# EAGLE design 16 ch sample-and-hold card - 2 (EAGLE 6.5.0)
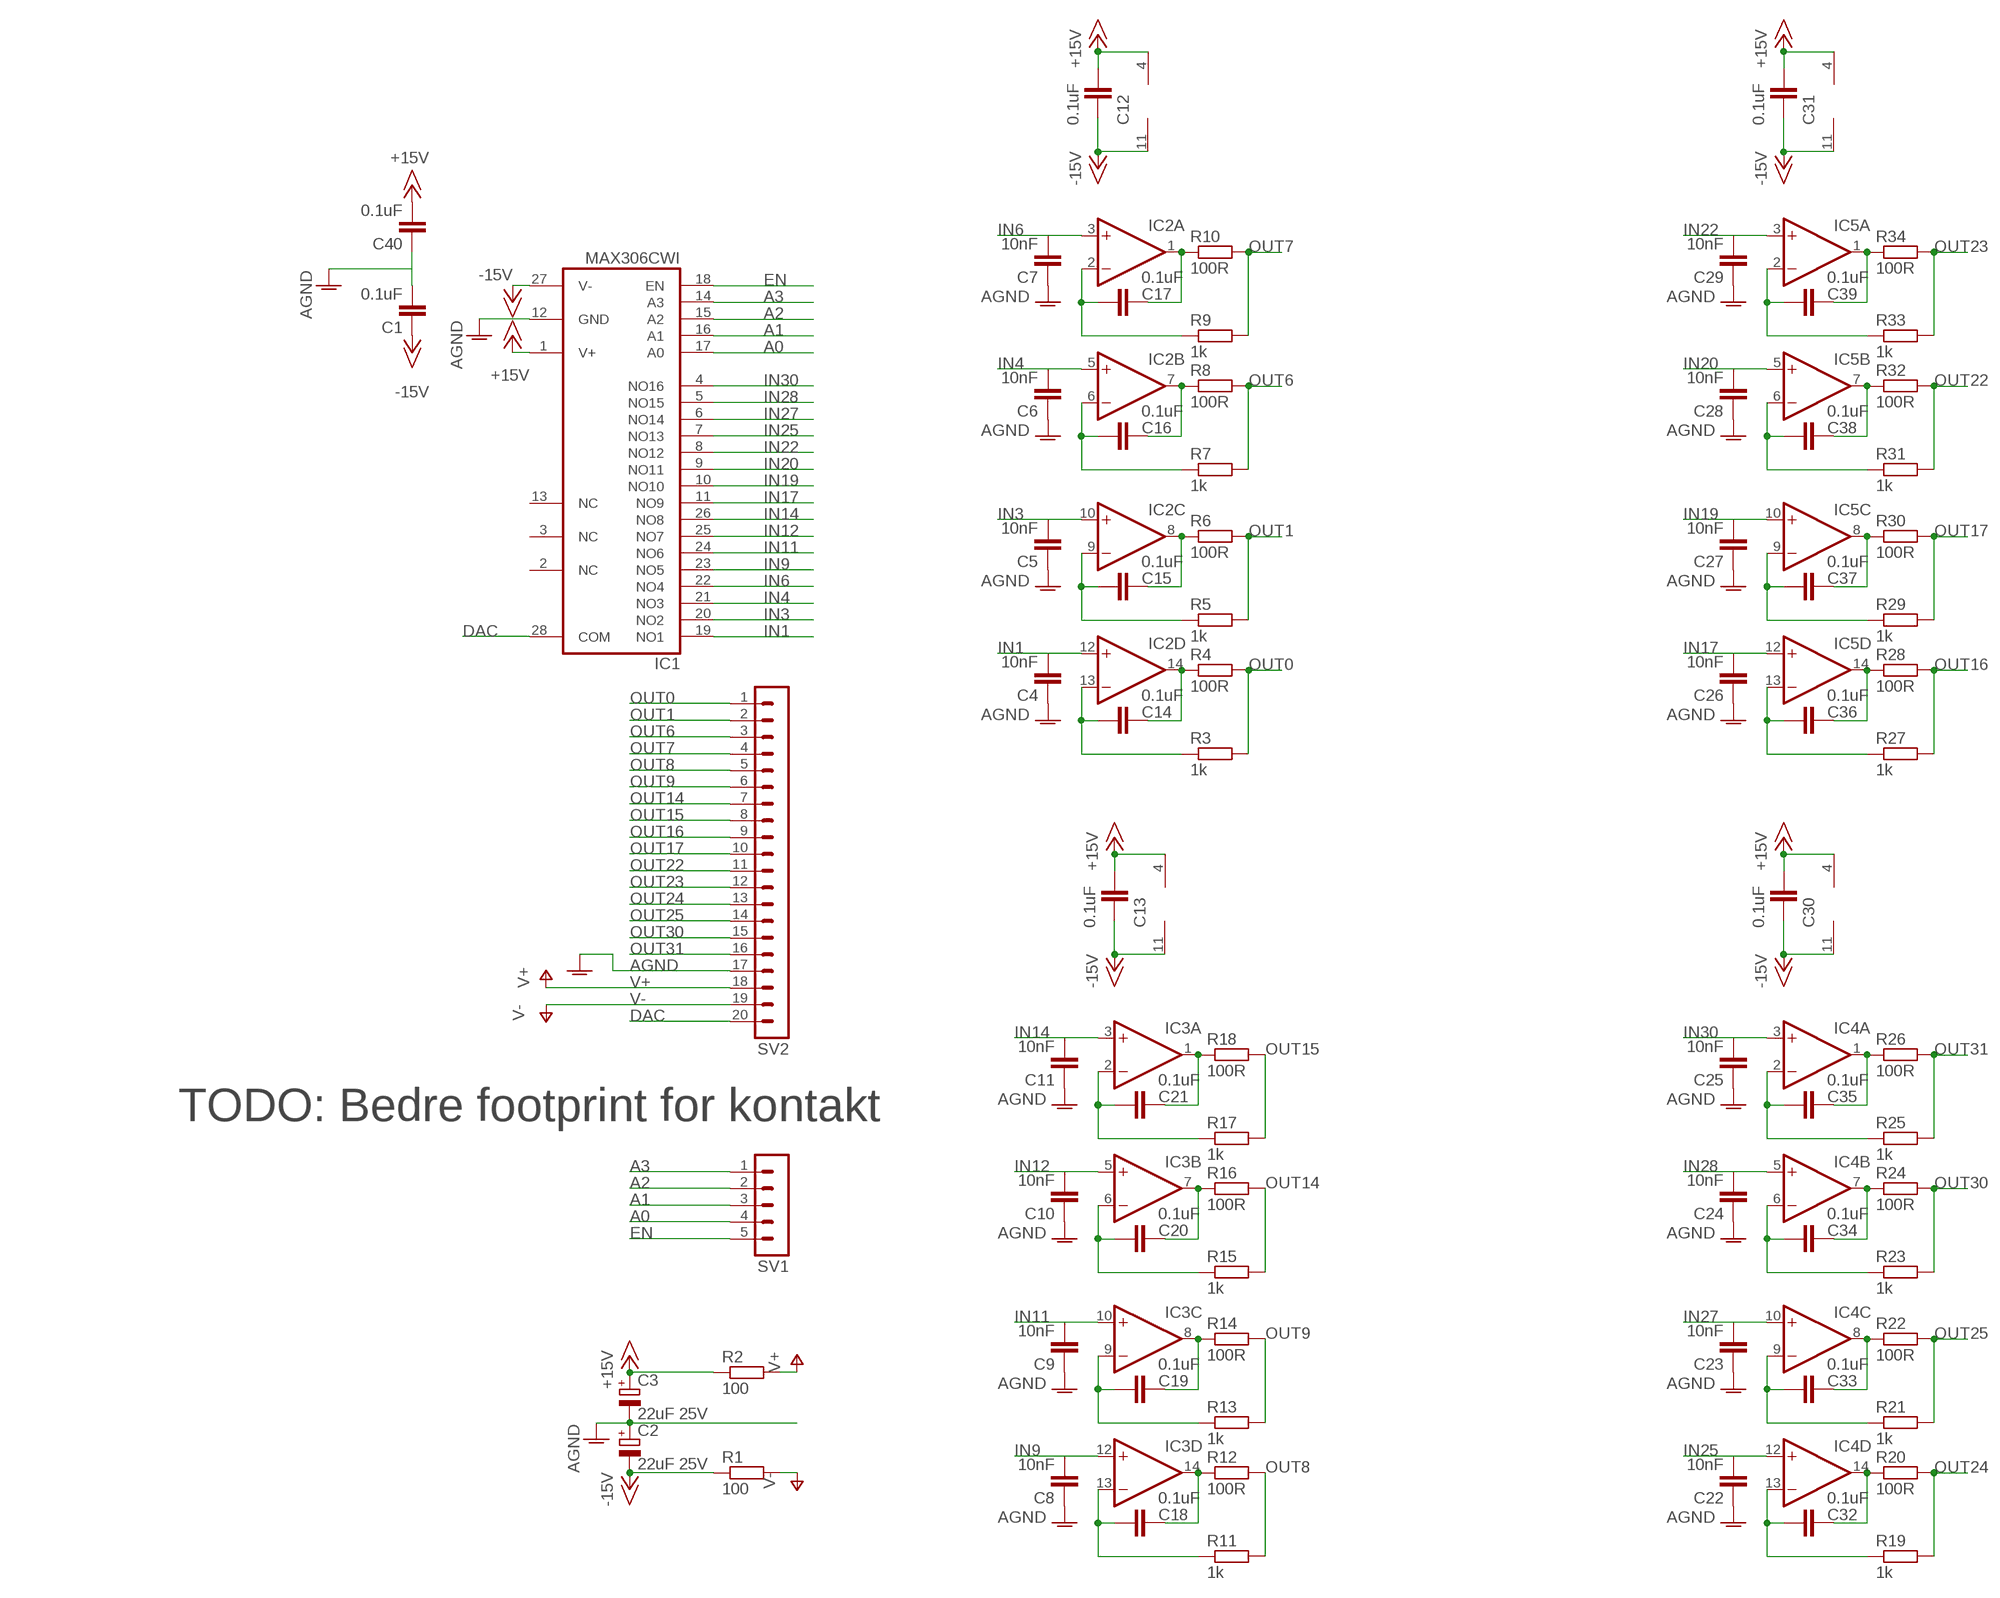
[diagram p0: schematic, sheet 1]

## Parts
C1  0.1uF  C-EUC0603  [C0603]
C2  22uF 25V  CPOL-EUE2-5  [E2-5]
C3  22uF 25V  CPOL-EUE2-5  [E2-5]
C4  10nF  C-EUC1206  [C1206]
C5  10nF  C-EUC1206  [C1206]
C6  10nF  C-EUC1206  [C1206]
C7  10nF  C-EUC1206  [C1206]
C8  10nF  C-EUC1206  [C1206]
C9  10nF  C-EUC1206  [C1206]
C10  10nF  C-EUC1206  [C1206]
C11  10nF  C-EUC1206  [C1206]
C12  0.1uF  C-EUC0603  [C0603]
C13  0.1uF  C-EUC0603  [C0603]
C14  0.1uF  C-EUC0603  [C0603]
C15  0.1uF  C-EUC0603  [C0603]
C16  0.1uF  C-EUC0603  [C0603]
C17  0.1uF  C-EUC0603  [C0603]
C18  0.1uF  C-EUC0603  [C0603]
C19  0.1uF  C-EUC0603  [C0603]
C20  0.1uF  C-EUC0603  [C0603]
C21  0.1uF  C-EUC0603  [C0603]
C22  10nF  C-EUC1206  [C1206]
C23  10nF  C-EUC1206  [C1206]
C24  10nF  C-EUC1206  [C1206]
C25  10nF  C-EUC1206  [C1206]
C26  10nF  C-EUC1206  [C1206]
C27  10nF  C-EUC1206  [C1206]
C28  10nF  C-EUC1206  [C1206]
C29  10nF  C-EUC1206  [C1206]
C30  0.1uF  C-EUC0603  [C0603]
C31  0.1uF  C-EUC0603  [C0603]
C32  0.1uF  C-EUC0603  [C0603]
C33  0.1uF  C-EUC0603  [C0603]
C34  0.1uF  C-EUC0603  [C0603]
C35  0.1uF  C-EUC0603  [C0603]
C36  0.1uF  C-EUC0603  [C0603]
C37  0.1uF  C-EUC0603  [C0603]
C38  0.1uF  C-EUC0603  [C0603]
C39  0.1uF  C-EUC0603  [C0603]
C40  0.1uF  C-EUC0603  [C0603]
IC1  MAX306CWI  [SO28L]
IC2  TL074D  [SO14]
IC3  TL074D  [SO14]
IC4  TL074D  [SO14]
IC5  TL074D  [SO14]
R1  100  R-EU_0207/7  [0207/7]
R2  100  R-EU_0207/7  [0207/7]
R3  1k  R-EU_R0603  [R0603]
R4  100R  R-EU_R0603  [R0603]
R5  1k  R-EU_R0603  [R0603]
R6  100R  R-EU_R0603  [R0603]
R7  1k  R-EU_R0603  [R0603]
R8  100R  R-EU_R0603  [R0603]
R9  1k  R-EU_R0603  [R0603]
R10  100R  R-EU_R0603  [R0603]
R11  1k  R-EU_R0603  [R0603]
R12  100R  R-EU_R0603  [R0603]
R13  1k  R-EU_R0603  [R0603]
R14  100R  R-EU_R0603  [R0603]
R15  1k  R-EU_R0603  [R0603]
R16  100R  R-EU_R0603  [R0603]
R17  1k  R-EU_R0603  [R0603]
R18  100R  R-EU_R0603  [R0603]
R19  1k  R-EU_R0603  [R0603]
R20  100R  R-EU_R0603  [R0603]
R21  1k  R-EU_R0603  [R0603]
R22  100R  R-EU_R0603  [R0603]
R23  1k  R-EU_R0603  [R0603]
R24  100R  R-EU_R0603  [R0603]
R25  1k  R-EU_R0603  [R0603]
R26  100R  R-EU_R0603  [R0603]
R27  1k  R-EU_R0603  [R0603]
R28  100R  R-EU_R0603  [R0603]
R29  1k  R-EU_R0603  [R0603]
R30  100R  R-EU_R0603  [R0603]
R31  1k  R-EU_R0603  [R0603]
R32  100R  R-EU_R0603  [R0603]
R33  1k  R-EU_R0603  [R0603]
R34  100R  R-EU_R0603  [R0603]
SV1  MA05-1  [MA05-1]
SV2  MA20-1  [MA20-1]

## Nets
+15V: C3.+ C12.1 C13.1 C30.1 C31.1 C40.2 IC1.1(V+) IC2.4(P:V+) IC3.4(P:V+) IC4.4(P:V+) IC5.4(P:V+) R2.1
-15V: C1.1 C2.- C12.2 C13.2 C30.2 C31.2 IC1.27(V-) IC2.11(P:V-) IC3.11(P:V-) IC4.11(P:V-) IC5.11(P:V-) R1.1
A0: IC1.17(A0) SV1.4
A1: IC1.16(A1) SV1.3
A2: IC1.15(A2) SV1.2
A3: IC1.14(A3) SV1.1
AGND: C1.2 C2.+ C3.- C4.1 C5.1 C6.1 C7.1 C8.1 C9.1 C10.1 C11.1 C22.1 C23.1 C24.1 C25.1 C26.1 C27.1 C28.1 C29.1 C40.1 IC1.12(GND) SV2.17
DAC: IC1.28(COM) SV2.20
EN: IC1.18(EN) SV1.5
IN1: C4.2 IC1.19(NO1) IC2.12(D:+IN)
IN3: C5.2 IC1.20(NO2) IC2.10(C:+IN)
IN4: C6.2 IC1.21(NO3) IC2.5(B:+IN)
IN6: C7.2 IC1.22(NO4) IC2.3(A:+IN)
IN9: C8.2 IC1.23(NO5) IC3.12(D:+IN)
IN11: C9.2 IC1.24(NO6) IC3.10(C:+IN)
IN12: C10.2 IC1.25(NO7) IC3.5(B:+IN)
IN14: C11.2 IC1.26(NO8) IC3.3(A:+IN)
IN17: C26.2 IC1.11(NO9) IC5.12(D:+IN)
IN19: C27.2 IC1.10(NO10) IC5.10(C:+IN)
IN20: C28.2 IC1.9(NO11) IC5.5(B:+IN)
IN22: C29.2 IC1.8(NO12) IC5.3(A:+IN)
IN25: C22.2 IC1.7(NO13) IC4.12(D:+IN)
IN27: C23.2 IC1.6(NO14) IC4.10(C:+IN)
IN28: C24.2 IC1.5(NO15) IC4.5(B:+IN)
IN30: C25.2 IC1.4(NO16) IC4.3(A:+IN)
N$1: C17.2 IC2.2(A:-IN) R9.1
N$2: C17.1 IC2.1(A:OUT) R10.1
N$3: C16.1 IC2.7(B:OUT) R8.1
N$4: C15.1 IC2.8(C:OUT) R6.1
N$5: C16.2 IC2.6(B:-IN) R7.1
N$6: C14.1 IC2.14(D:OUT) R4.1
N$7: C15.2 IC2.9(C:-IN) R5.1
N$8: C14.2 IC2.13(D:-IN) R3.1
N$9: C21.1 IC3.1(A:OUT) R18.1
N$10: C21.2 IC3.2(A:-IN) R17.1
N$19: C20.1 IC3.7(B:OUT) R16.1
N$20: C20.2 IC3.6(B:-IN) R15.1
N$21: C19.1 IC3.8(C:OUT) R14.1
N$22: C18.1 IC3.14(D:OUT) R12.1
N$23: C19.2 IC3.9(C:-IN) R13.1
N$24: C18.2 IC3.13(D:-IN) R11.1
N$33: C39.1 IC5.1(A:OUT) R34.1
N$34: C39.2 IC5.2(A:-IN) R33.1
N$35: C38.1 IC5.7(B:OUT) R32.1
N$36: C38.2 IC5.6(B:-IN) R31.1
N$37: C37.1 IC5.8(C:OUT) R30.1
N$38: C36.1 IC5.14(D:OUT) R28.1
N$39: C37.2 IC5.9(C:-IN) R29.1
N$40: C36.2 IC5.13(D:-IN) R27.1
N$49: C35.1 IC4.1(A:OUT) R26.1
N$50: C35.2 IC4.2(A:-IN) R25.1
N$51: C34.1 IC4.7(B:OUT) R24.1
N$52: C34.2 IC4.6(B:-IN) R23.1
N$53: C33.1 IC4.8(C:OUT) R22.1
N$54: C32.1 IC4.14(D:OUT) R20.1
N$55: C33.2 IC4.9(C:-IN) R21.1
N$56: C32.2 IC4.13(D:-IN) R19.1
OUT0: R3.2 R4.2 SV2.1
OUT1: R5.2 R6.2 SV2.2
OUT6: R7.2 R8.2 SV2.3
OUT7: R9.2 R10.2 SV2.4
OUT8: R11.2 R12.2 SV2.5
OUT9: R13.2 R14.2 SV2.6
OUT14: R15.2 R16.2 SV2.7
OUT15: R17.2 R18.2 SV2.8
OUT16: R27.2 R28.2 SV2.9
OUT17: R29.2 R30.2 SV2.10
OUT22: R31.2 R32.2 SV2.11
OUT23: R33.2 R34.2 SV2.12
OUT24: R19.2 R20.2 SV2.13
OUT25: R21.2 R22.2 SV2.14
OUT30: R23.2 R24.2 SV2.15
OUT31: R25.2 R26.2 SV2.16
V+: R2.2 SV2.18
V-: R1.2 SV2.19
Unconnected: IC1.2(NC) IC1.3(NC) IC1.13(NC)

## Notes on the sheet
- TODO: Bedre footprint for kontakt

## Library data of the parts
C1 C4-C40 = resistor:C-EU: CAPACITOR, European symbol
C2 C3 = resistor:CPOL-EU: POLARIZED CAPACITOR, European symbol
IC1 = maxim:MAX306CWI: MULTIPLEXER; MF: MAXIM; MPN: MAX306CWI; OC_FARNELL: unknown; OC_NEWARK: 90C2555
IC2-IC5 = linear:TL074: OP AMP
R1-R34 = resistor:R-EU_: RESISTOR, European symbol
SV1 = joakim:MA05-1: PIN HEADER; OC_FARNELL: unknown; OC_NEWARK: unknown
SV2 = joakim:MA20-1: PIN HEADER; OC_FARNELL: unknown; OC_NEWARK: unknown

## Board
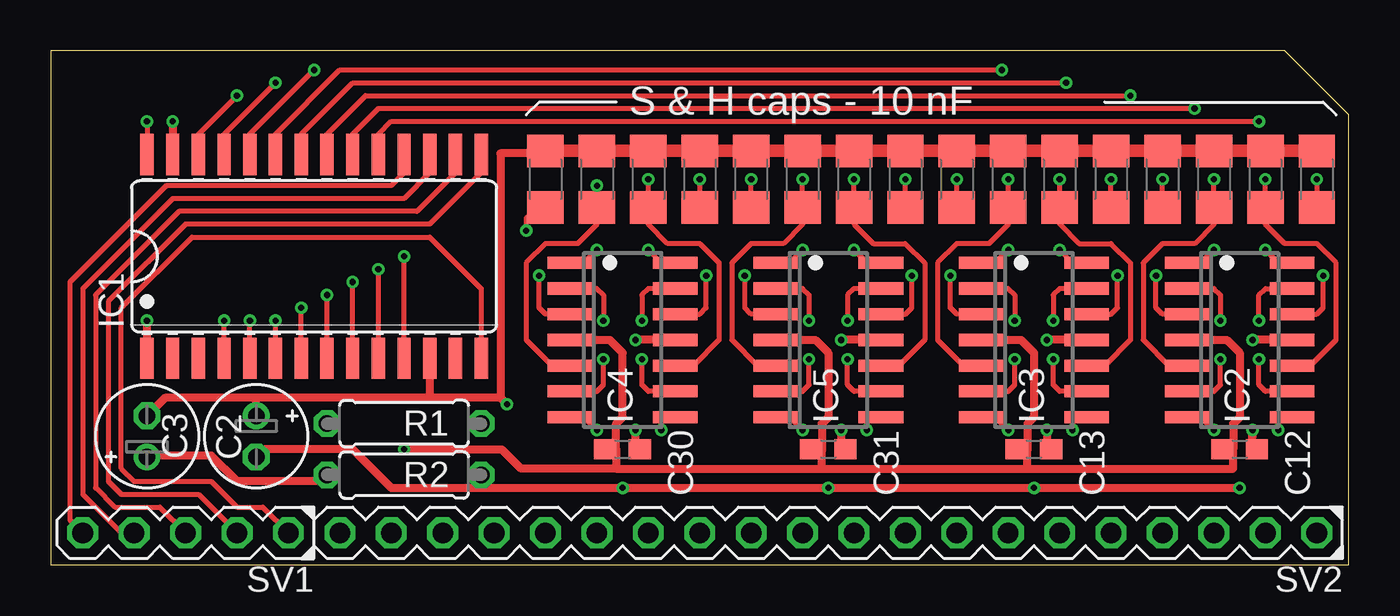
[diagram p1: board, top side]
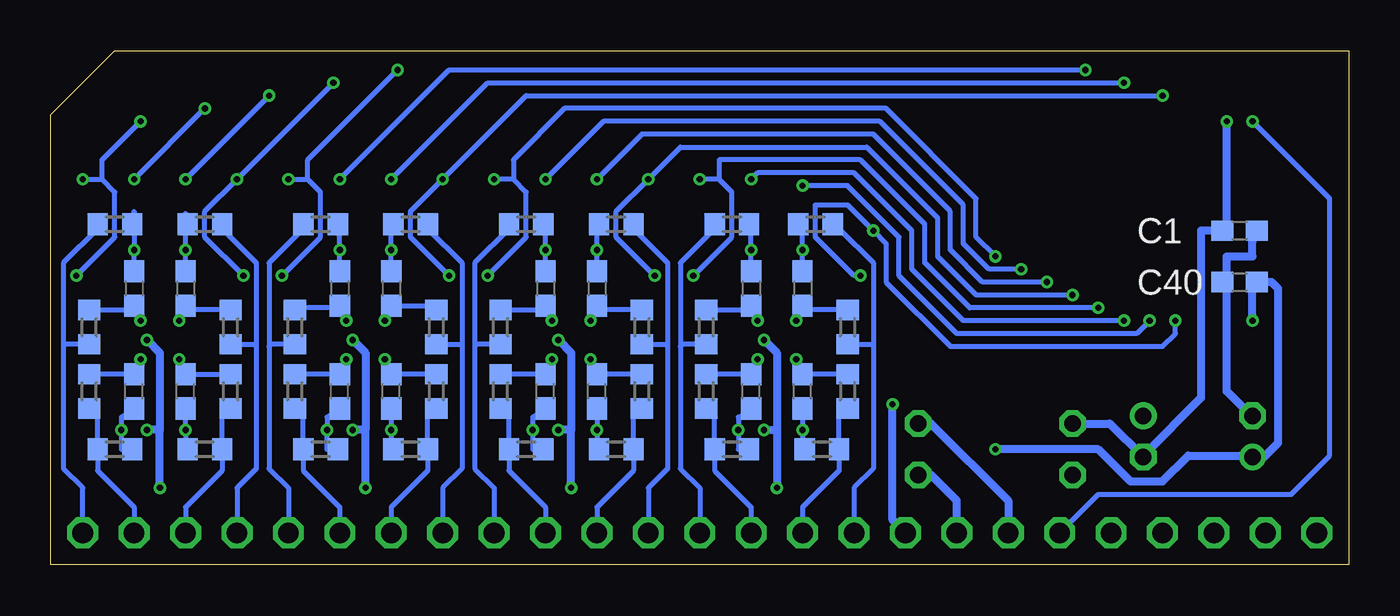
[diagram p2: board, bottom side, seen from below]

Size 64.14 x 25.4 mm. Coordinates in mm from the lower left corner, seen from the top.
Outline: 0,0 64.14,0 64.14,22.23 60.96,25.4 0,25.4 0,0
Copper layers (1*16): Top 0.035mm / dielectric 1.5mm / Bottom 0.035mm
Design rules "dirt_cheap_dirty_boards.v1": minimum track width 5mil, minimum drill 12mil, track to track 5mil, track to pad 5mil, pad to pad 5mil, via to via 5mil, smd to smd 0mil, copper to edge 10mil, drill to drill 10mil, minimum pad ring 10mil, minimum via ring 6mil, stop-mask expansion 2mil, vias tented up to drill 25mil, thermal gap 10mil

### Footprints (pad centres in the part's own frame; a part is rotated, then mirrored left to right if it is on the bottom)
C0603 = smd 1.1 x 1: 1 -0.85,0; 2 0.85,0
E2-5 = drill 0.813 pad 1.27: + -1.016,0 | drill 0.813 pad 1.27 octagon: - 1.016,0
C1206 = smd 1.6 x 1.8: 1 -1.4,0; 2 1.4,0
SO28L = smd 0.66 x 2.032: 1 -8.255,-5.029; 2 -6.985,-5.029; 3 -5.715,-5.029; 4 -4.445,-5.029; 5 -3.175,-5.029; 6 -1.905,-5.029; 7 -0.635,-5.029; 8 0.635,-5.029; 9 1.905,-5.029; 10 3.175,-5.029; 11 4.445,-5.029; 12 5.715,-5.029; 13 6.985,-5.029; 14 8.255,-5.029; 15 8.255,5.029; 16 6.985,5.029; 17 5.715,5.029; 18 4.445,5.029; 19 3.175,5.029; 20 1.905,5.029; 21 0.635,5.029; 22 -0.635,5.029; 23 -1.905,5.029; 24 -3.175,5.029; 25 -4.445,5.029; 26 -5.715,5.029; 27 -6.985,5.029; 28 -8.255,5.029
SO14 = smd 0.6 x 2.2: 1 -3.81,-2.6; 2 -2.54,-2.6; 3 -1.27,-2.6; 4 0,-2.6; 5 1.27,-2.6; 6 2.54,-2.6; 7 3.81,-2.6; 8 3.81,2.6; 9 2.54,2.6; 10 1.27,2.6; 11 0,2.6; 12 -1.27,2.6; 13 -2.54,2.6; 14 -3.81,2.6
0207/7 = drill 0.813 octagon: 1 -3.81,0; 2 3.81,0
R0603 = smd 1 x 1.1: 1 -0.85,0; 2 0.85,0
MA05-1 = drill 1.016 octagon: 1 -5.08,0; 2 -2.54,0; 3 0,0; 4 2.54,0; 5 5.08,0
MA20-1 = drill 1.016 octagon: 1 -24.13,0; 2 -21.59,0; 3 -19.05,0; 4 -16.51,0; 5 -13.97,0; 6 -11.43,0; 7 -8.89,0; 8 -6.35,0; 9 -3.81,0; 10 -1.27,0; 11 1.27,0; 12 3.81,0; 13 6.35,0; 14 8.89,0; 15 11.43,0; 16 13.97,0; 17 16.51,0; 18 19.05,0; 19 21.59,0; 20 24.13,0

### Placement (x,y rotation side)
C1  5.4,16.51 0 bottom
C2  10.16,6.35 270 top
C3  4.76,6.35 90 top
C4  62.55,19.05 270 top
C5  60.01,19.05 270 top
C6  57.47,19.05 270 top
C7  54.93,19.05 270 top
C8  52.39,19.05 270 top
C9  49.85,19.05 270 top
C10  47.31,19.05 270 top
C11  44.77,19.05 270 top
C12  58.74,5.71 0 top
C13  48.58,5.71 0 top
C14  60.01,13.65 270 bottom
C15  60.01,8.57 90 bottom
C16  57.47,8.57 90 bottom
C17  57.47,13.65 270 bottom
C18  49.85,13.65 270 bottom
C19  49.85,8.57 90 bottom
C20  47.31,8.57 90 bottom
C21  47.31,13.65 270 bottom
C22  32.07,19.05 270 top
C23  29.53,19.05 270 top
C24  26.99,19.05 270 top
C25  24.45,19.05 270 top
C26  42.23,19.05 270 top
C27  39.69,19.05 270 top
C28  37.15,19.05 270 top
C29  34.61,19.05 270 top
C30  28.26,5.71 0 top
C31  38.42,5.71 0 top
C32  29.53,13.65 270 bottom
C33  29.53,8.57 90 bottom
C34  26.99,8.57 90 bottom
C35  26.99,13.65 270 bottom
C36  39.69,13.65 270 bottom
C37  39.69,8.57 90 bottom
C38  37.15,8.57 90 bottom
C39  37.15,13.65 270 bottom
C40  5.4,13.97 0 bottom
IC1  13.02,15.24 0 top
IC2  58.74,11.11 270 top
IC3  48.58,11.11 270 top
IC4  28.26,11.11 270 top
IC5  38.42,11.11 270 top
R1  17.46,6.99 0 top
R2  17.46,4.45 0 top
R3  62.23,11.75 270 bottom
R4  60.96,16.83 180 bottom
R5  62.23,8.57 270 bottom
R6  60.96,5.71 180 bottom
R7  55.24,8.57 270 bottom
R8  56.52,5.71 0 bottom
R9  55.24,11.75 270 bottom
R10  56.52,16.83 0 bottom
R11  52.07,11.75 270 bottom
R12  50.8,16.83 180 bottom
R13  52.07,8.57 270 bottom
R14  50.8,5.71 180 bottom
R15  45.09,8.57 270 bottom
R16  46.35,5.71 0 bottom
R17  45.09,11.75 270 bottom
R18  46.35,16.83 0 bottom
R19  31.75,11.75 270 bottom
R20  30.48,16.83 180 bottom
R21  31.75,8.57 270 bottom
R22  30.48,5.71 180 bottom
R23  24.77,8.57 270 bottom
R24  26.04,5.71 0 bottom
R25  24.77,11.75 270 bottom
R26  26.35,16.83 0 bottom
R27  41.91,11.75 270 bottom
R28  40.64,16.83 180 bottom
R29  41.91,8.57 270 bottom
R30  40.64,5.71 180 bottom
R31  34.92,8.57 270 bottom
R32  36.2,5.71 0 bottom
R33  34.92,11.75 270 bottom
R34  36.2,16.83 0 bottom
SV1  6.67,1.59 180 top
SV2  38.42,1.59 180 top

### Tracks (layer width: path | path; a pad name or v marks a point on that pad's centre or on a via)
+15V  (via drill 0.3)
  Top 0.406: IC3.4 47.94,11.11 48.58,10.48 48.58,7.3 48.26,6.99 48.26,5.71 | 37.47,5.71 C31.1 38.1,5.61 | IC2.4 58.1,11.11 58.74,10.48 58.74,7.3 58.42,6.99 58.42,5.71 | 58.42,5.61 C12.1 58.42,5.71 | IC5.4 37.78,11.11 38.42,10.48 38.42,7.3 38.1,6.99 38.1,5.61 | 27.94,5.71 27.41,5.82 C30.1 27.94,5.71 | 27.94,5.71 27.94,6.99 28.26,7.3 28.26,10.48 27.62,11.11 IC4.4 | 27.94,5.71 27.94,4.76 | 27.94,4.76 23.24,4.76 22.29,5.71 v17.46,5.71 | 27.94,4.76 38.1,4.76 | 38.1,4.76 48.26,4.76 | 48.26,4.76 58.42,4.76 58.42,5.61 | 58.42,5.61 58.42,5.71 | 38.1,4.76 38.1,5.61 | 48.26,4.76 48.26,5.71 | 48.26,5.71 C13.1 | IC1.1 v4.76,12.06 | R2.1 13.34,4.13 9.21,4.13 7.94,5.4 4.83,5.4 C3.+
  Bottom 0.406: v4.76,12.06 4.76,13.76 C40.2 3.81,13.97 3.49,13.65 3.49,6.03 4.19,5.33 C3.+ 4.83,5.4 7.94,5.4 9.21,4.13 10.79,4.13 12.38,5.71 v17.46,5.71
-15V  (via drill 0.3)
  Top 0.406: IC4.11 v28.89,11.11 | C30.2 28.89,5.71 v28.89,6.67 | IC5.11 v39.05,11.11 | v39.05,6.67 39.05,5.71 C31.2 | IC2.11 v59.37,11.11 | 59.37,6.35 v59.37,6.67 59.37,5.71 C12.2 | IC3.11 v49.21,11.11 | v49.21,6.67 49.21,5.93 C13.2 | v58.74,3.81 v48.58,3.81 v38.42,3.81 v28.26,3.81 16.83,3.81 14.92,5.71 10.54,5.71 C2.- 10.16,5.4 | v6.03,21.91 IC1.27
  Bottom 0.406: v28.89,11.11 28.26,10.48 28.26,6.67 | 28.26,6.67 v28.26,3.81 | v28.89,6.67 28.26,6.67 | v39.05,11.11 38.42,10.48 38.42,6.67 | v38.42,3.81 38.42,6.67 | 38.42,6.67 v39.05,6.67 | v59.37,11.11 58.74,10.48 58.74,6.67 | v58.74,3.81 58.74,6.67 | 58.74,6.67 v59.37,6.67 | v49.21,11.11 48.58,10.48 48.58,6.67 | v48.58,3.81 48.58,6.67 | 48.58,6.67 v49.21,6.67 | R1.1 11.81,6.99 C2.- 10.16,5.4 7.3,8.26 7.3,16.51 C1.1 6.03,16.51 v6.03,21.91
A0
  Top 0.254: IC1.17 18.73,19.37 17.46,18.1 6.03,18.1 1.59,13.65 1.59,3.49 3.49,1.59 SV1.4
A1
  Top 0.254: IC1.16 20,19.37 18.1,17.46 6.35,17.46 2.22,13.34 2.22,3.81 3.17,2.86 5.4,2.86 SV1.3
A2
  Top 0.254: IC1.15 21.27,19.37 18.73,16.83 6.67,16.83 2.86,13.02 2.86,4.13 3.49,3.49 7.3,3.49 SV1.2
A3
  Top 0.254: IC1.14 21.27,13.65 18.73,16.19 6.99,16.19 3.49,12.7 3.49,4.76 4.13,4.13 7.94,4.13 9.21,2.86 10.48,2.86 SV1.1
AGND  (via drill 0.3)
  Top 0.254: 58.1,20.45 C6.1
  Top 0.406: IC1.12 18.73,8.26 | C25.1 23.94,20.45 23.81,20.32 22.23,20.32 22.23,8.26 | 22.23,8.26 18.73,8.26 | v22.54,7.94 22.23,8.26 | 18.73,8.26 10.16,8.26 | C2.+ 10.16,8.26 | 10.16,8.26 5.65,8.26 C3.-
  Top 0.61: C4.1 C5.1 C6.1 C7.1 C8.1 C9.1 C10.1 C11.1 C26.1 C27.1 C28.1 C29.1 C22.1 C23.1 C24.1 C25.1
  Bottom 0.406: SV2.17 22.54,2.22 v22.54,7.94 | C3.- 4.83,7.37 6.03,8.57 6.03,13.76 C40.1 6.25,14.07 6.03,14.29 6.03,15.24 4.76,15.24 4.76,15.98 C1.2
DAC  (via drill 0.3)
  Top 0.254: v4.76,21.91 IC1.28
  Bottom 0.254: SV2.20 12.38,3.49 2.86,3.49 0.95,5.4 0.95,18.1 v4.76,21.91
EN
  Top 0.254: IC1.18 17.46,19.37 16.83,18.73 5.71,18.73 0.95,13.97 0.95,2.22 SV1.5
IN1  (via drill 0.3)
  Top 0.254: v62.55,19.05 C4.2 | IC2.12 62.55,12.38 62.87,12.7 v62.87,14.29 | IC1.19 16.19,21.27 16.83,21.91 v59.69,21.91
  Bottom 0.254: v62.87,14.29 60.96,16.19 60.96,18.41 61.59,19.05 | v62.55,19.05 61.59,19.05 | 61.59,19.05 61.59,20 v59.69,21.91
IN3  (via drill 0.3)
  Top 0.254: IC2.10 62.23,9.84 63.5,11.11 63.5,14.92 62.55,15.88 60.96,15.88 60.01,16.83 C5.2 v60.01,19.05 | IC1.20 14.92,21.27 16.19,22.54 v56.52,22.54
  Bottom 0.254: v60.01,19.05 v56.52,22.54
IN4  (via drill 0.3)
  Top 0.254: v57.47,19.05 C6.2 57.47,16.83 56.52,15.88 54.93,15.88 53.98,14.92 53.98,11.11 55.24,9.84 IC2.5 | IC1.21 13.65,21.27 15.56,23.18 v53.34,23.18
  Bottom 0.254: v57.47,19.05 v53.34,23.18
IN6  (via drill 0.3)
  Top 0.254: C7.2 v54.93,19.05 | IC2.3 54.93,12.38 54.61,12.7 v54.61,14.29 | IC1.22 12.38,21.27 14.92,23.81 v50.16,23.81
  Bottom 0.254: v54.61,14.29 56.52,16.19 56.52,17.46 v54.93,19.05 v50.16,23.81
IN9  (via drill 0.3)
  Top 0.254: C8.2 v52.39,19.05 | IC3.12 52.39,12.38 52.7,12.7 v52.7,14.29 | IC1.23 11.11,21.27 14.29,24.45 v46.99,24.45
  Bottom 0.254: v52.7,14.29 50.8,16.19 50.8,18.41 51.44,19.05 | v52.39,19.05 51.44,19.05 | 51.44,19.05 51.44,20 v46.99,24.45
IN11  (via drill 0.3)
  Top 0.254: IC3.10 52.07,9.84 53.34,11.11 53.34,14.92 52.39,15.88 50.8,15.88 49.85,16.83 C9.2 v49.85,19.05 | IC1.24 9.84,21.27 v13.02,24.45
  Bottom 0.254: v49.85,19.05 44.45,24.45 v13.02,24.45
IN12  (via drill 0.3)
  Top 0.254: IC3.5 45.09,9.84 43.81,11.11 43.81,14.92 44.77,15.88 46.35,15.88 47.31,16.83 C10.2 v47.31,19.05 | IC1.25 8.57,21.27 v11.11,23.81
  Bottom 0.254: v47.31,19.05 42.55,23.81 v11.11,23.81
IN14  (via drill 0.3)
  Top 0.254: C11.2 v44.77,19.05 | IC3.3 44.77,12.38 44.45,12.7 v44.45,14.29 | IC1.26 7.3,21.27 v9.21,23.18
  Bottom 0.254: v44.45,14.29 46.35,16.19 46.35,17.46 v44.77,19.05 40.64,23.18 v9.21,23.18
IN17  (via drill 0.3)
  Top 0.254: C26.2 v42.23,19.05 | IC5.12 42.23,12.38 42.55,12.7 v42.55,14.29 | IC1.11 v17.46,15.24
  Bottom 0.254: v42.55,14.29 40.64,16.19 40.64,18.41 41.27,19.05 | v17.46,15.24 18.41,16.19 18.41,18.1 22.86,22.54 38.73,22.54 41.27,20 41.27,19.05 | 41.27,19.05 v42.23,19.05
IN19  (via drill 0.3)
  Top 0.254: IC5.10 41.91,9.84 43.18,11.11 43.18,14.92 42.23,15.88 40.64,15.88 39.69,16.83 C27.2 v39.69,19.05 | IC1.10 v16.19,14.61
  Bottom 0.254: v16.19,14.61 17.78,14.61 19.05,15.88 19.05,17.78 23.18,21.91 36.83,21.91 v39.69,19.05
IN20  (via drill 0.3)
  Top 0.254: IC5.5 34.92,9.84 33.66,11.11 33.66,14.92 34.61,15.88 36.2,15.88 37.15,16.83 C28.2 v37.15,19.05 | IC1.9 v14.92,13.97
  Bottom 0.254: v14.92,13.97 18.1,13.97 19.68,15.56 19.68,17.46 23.5,21.27 34.92,21.27 v37.15,19.05
IN22  (via drill 0.3)
  Top 0.254: C29.2 v34.61,19.05 | IC5.3 34.61,12.38 34.29,12.7 v34.29,14.29 | IC1.8 v13.65,13.34
  Bottom 0.254: v34.29,14.29 36.2,16.19 36.2,17.46 v34.61,19.05 33.02,20.64 23.81,20.64 20.32,17.14 20.32,15.24 18.41,13.34 v13.65,13.34
IN25  (via drill 0.3)
  Top 0.254: C22.2 v32.07,19.05 | IC4.12 32.07,12.38 32.38,12.7 v32.38,14.29 | IC1.7 v12.38,12.7
  Bottom 0.254: v32.38,14.29 30.48,16.19 30.48,18.41 31.11,19.05 | v12.38,12.7 18.73,12.7 20.95,14.92 20.95,16.83 24.13,20 31.11,20 31.11,19.05 | 31.11,19.05 v32.07,19.05
IN27  (via drill 0.3)
  Top 0.254: IC4.10 31.75,9.84 33.02,11.11 33.02,14.92 32.07,15.88 30.48,15.88 29.53,16.83 C23.2 v29.53,19.05 | IC1.6 v11.11,12.06
  Bottom 0.254: v11.11,12.06 19.05,12.06 21.59,14.61 21.59,16.51 24.45,19.37 29.21,19.37 v29.53,19.05
IN28  (via drill 0.3)
  Top 0.254: IC4.5 24.77,9.84 23.5,11.11 23.5,14.92 24.45,15.88 26.04,15.88 26.99,16.83 C24.2 v26.99,18.73 | IC1.5 v9.84,12.06
  Bottom 0.254: v9.84,12.06 10.48,11.43 19.37,11.43 22.23,14.29 22.23,16.19 24.77,18.73 v26.99,18.73
IN30  (via drill 0.3)
  Top 0.254: C25.2 24.45,17.78 23.5,17.14 v23.5,16.51 | IC4.3 24.45,12.38 24.13,12.7 v24.13,14.29 | IC1.4 v8.57,12.06
  Bottom 0.254: v24.13,14.29 24.45,14.29 26.35,16.19 26.35,17.78 24.77,17.78 v23.5,16.51 22.86,15.88 22.86,13.97 19.68,10.79 9.21,10.79 8.57,11.43 v8.57,12.06
N$1  (via drill 0.3)
  Top 0.254: IC2.2 57.47,13.65 57.78,13.34 v57.78,12.06
  Bottom 0.254: v57.78,12.06 57.78,12.7 57.68,12.8 C17.2 57.26,12.6 R9.1
N$2  (via drill 0.3)
  Top 0.254: IC2.1 56.83,14.92 v57.47,15.56
  Bottom 0.254: C17.1 v57.47,15.56 57.47,17.36 R10.1
N$3  (via drill 0.3)
  Top 0.254: IC2.7 56.83,7.3 v57.47,6.67
  Bottom 0.254: R8.1 57.47,5.82 v57.47,6.67 C16.1
N$4  (via drill 0.3)
  Top 0.254: IC2.8 60.64,7.3 v60.64,6.67
  Bottom 0.254: R6.1 60.11,5.29 | 60.01,5.5 R6.1 | R6.1 60.64,5.71 v60.64,6.67 60.64,7.3 C15.1
N$5  (via drill 0.3)
  Top 0.254: IC2.6 57.47,8.57 57.78,8.89 v57.78,10.16
  Bottom 0.254: R7.1 C16.2 57.78,9.74 v57.78,10.16
N$6  (via drill 0.3)
  Top 0.254: v60.01,15.56 60.64,14.92 IC2.14
  Bottom 0.254: C14.1 v60.01,15.56 60.01,17.46 R4.1
N$7  (via drill 0.3)
  Top 0.254: IC2.9 60.01,8.57 59.69,8.89 v59.69,10.16
  Bottom 0.254: R5.1 C15.2 59.69,9.11 v59.69,10.16
N$8  (via drill 0.3)
  Top 0.254: v59.69,12.06 59.69,13.34 60.01,13.65 IC2.13
  Bottom 0.254: C14.2 59.69,12.7 | 59.69,12.7 v59.69,12.06 | R3.1 59.79,12.6 59.69,12.7
N$9  (via drill 0.3)
  Top 0.254: IC3.1 46.67,14.92 v47.31,15.56
  Bottom 0.254: R18.1 47.31,16.73 v47.31,15.56 C21.1
N$10  (via drill 0.3)
  Top 0.254: IC3.2 47.31,13.65 47.62,13.34 v47.62,12.06
  Bottom 0.254: R17.1 44.77,12.91 44.77,12.7 44.98,12.8 C21.2 47.62,12.48 v47.62,12.06
N$19  (via drill 0.3)
  Top 0.254: IC3.7 46.67,7.3 v47.31,6.67
  Bottom 0.254: R16.1 47.31,5.82 v47.31,6.67 C20.1
N$20  (via drill 0.3)
  Top 0.254: IC3.6 47.31,8.57 47.62,8.89 v47.62,10.16
  Bottom 0.254: v47.62,10.16 47.62,9.74 C20.2 R15.1
N$21  (via drill 0.3)
  Top 0.254: IC3.8 50.48,7.3 v50.48,6.67
  Bottom 0.254: R14.1 49.85,5.82 50.48,5.71 v50.48,6.67 50.48,7.3 C19.1
N$22  (via drill 0.3)
  Top 0.254: IC3.14 50.48,14.92 v49.85,15.56
  Bottom 0.254: R12.1 49.85,16.73 v49.85,15.56 C18.1
N$23  (via drill 0.3)
  Top 0.254: IC3.9 49.85,8.57 49.53,8.89 v49.53,10.16
  Bottom 0.254: v49.53,10.16 49.53,9.74 C19.2 R13.1
N$24  (via drill 0.3)
  Top 0.254: IC3.13 49.85,13.65 49.53,13.34 v49.53,12.06
  Bottom 0.254: v49.53,12.06 49.53,12.48 C18.2 50.06,12.8 50.16,12.7 51.65,12.7 R11.1
N$33  (via drill 0.3)
  Top 0.254: IC5.1 36.51,14.92 v37.15,15.56
  Bottom 0.254: R34.1 37.15,16.73 v37.15,15.56 C39.1
N$34  (via drill 0.3)
  Top 0.254: IC5.2 37.15,13.65 37.47,13.34 v37.47,12.06
  Bottom 0.254: v37.47,12.06 37.47,12.48 C39.2 36.94,12.6 R33.1
N$35  (via drill 0.3)
  Top 0.254: IC5.7 36.51,7.3 v37.15,6.67
  Bottom 0.254: R32.1 37.15,5.82 v37.15,6.67 C38.1
N$36  (via drill 0.3)
  Top 0.254: IC5.6 37.15,8.57 37.47,8.89 v37.47,10.16
  Bottom 0.254: v37.47,10.16 37.47,9.42 C38.2 R31.1
N$37  (via drill 0.3)
  Top 0.254: IC5.8 40.32,7.3 v40.32,6.67
  Bottom 0.254: 39.69,5.82 R30.1 40.32,5.71 v40.32,6.67 40.32,7.3 C37.1
N$38  (via drill 0.3)
  Top 0.254: IC5.14 40.32,14.92 v39.69,15.56
  Bottom 0.254: R28.1 39.69,16.73 v39.69,15.56 C36.1
N$39  (via drill 0.3)
  Top 0.254: IC5.9 39.69,8.57 39.37,8.89 v39.37,10.16
  Bottom 0.254: v39.37,10.16 39.37,9.74 C37.2 R29.1
N$40  (via drill 0.3)
  Top 0.254: IC5.13 39.69,13.65 39.37,13.34 v39.37,12.06
  Bottom 0.254: v39.37,12.06 39.37,12.48 C36.2 39.89,12.6 R27.1
N$49  (via drill 0.3)
  Top 0.254: IC4.1 26.35,14.92 v26.99,15.56
  Bottom 0.254: R26.1 26.99,16.73 v26.99,15.56 C35.1
N$50  (via drill 0.3)
  Top 0.254: IC4.2 26.99,13.65 27.3,13.34 v27.3,12.06
  Bottom 0.254: v27.3,12.06 27.3,12.48 C35.2 26.78,12.6 R25.1
N$51  (via drill 0.3)
  Top 0.254: IC4.7 26.35,7.3 v26.99,6.67
  Bottom 0.254: R24.1 26.99,5.82 v26.99,6.67 C34.1
N$52  (via drill 0.3)
  Top 0.254: IC4.6 26.99,8.57 27.3,8.89 v27.3,10.16
  Bottom 0.254: R23.1 C34.2 27.3,9.74 v27.3,10.16
N$53  (via drill 0.3)
  Top 0.254: IC4.8 30.16,7.3 v30.16,6.67
  Bottom 0.254: 29.53,5.82 R22.1 30.16,5.71 v30.16,6.67 30.16,7.3 29.53,7.62 C33.1
N$54  (via drill 0.3)
  Top 0.254: IC4.14 30.16,14.92 v29.53,15.56
  Bottom 0.254: R20.1 29.53,16.73 v29.53,15.56 C32.1
N$55  (via drill 0.3)
  Top 0.254: IC4.9 29.53,8.57 29.21,8.89 v29.21,10.16
  Bottom 0.254: v29.21,10.16 29.21,9.74 C33.2 R21.1
N$56  (via drill 0.3)
  Top 0.254: IC4.13 29.53,13.65 29.21,13.34 v29.21,12.06
  Bottom 0.254: v29.21,12.06 29.21,12.48 C32.2 29.73,12.6 R19.1
OUT0
  Bottom 0.254: R4.2 61.81,16.61 63.5,14.92 63.5,10.79 | 63.5,10.79 63.5,4.76 62.55,3.81 SV2.1 | R3.2 63.4,10.9 63.5,10.79
OUT1
  Bottom 0.254: R5.2 61.81,7.3 R6.2 61.81,4.66 60.01,2.86 SV2.2
OUT6
  Bottom 0.254: R8.2 55.66,7.3 R7.2 | R8.2 55.56,5.71 | R8.2 55.66,4.66 57.47,2.86 SV2.3
OUT7
  Bottom 0.254: 55.56,16.83 R10.2 55.66,16.61 53.98,14.92 53.98,10.79 | 53.98,10.79 53.98,4.76 54.93,3.81 SV2.4 | R9.2 54.08,10.9 53.98,10.79
OUT8
  Bottom 0.254: R12.2 51.65,16.61 53.34,14.92 53.34,10.79 | 53.34,10.79 53.34,4.76 52.39,3.81 SV2.5 | R11.2 53.24,10.9 53.34,10.79
OUT9
  Bottom 0.254: R13.2 51.65,7.3 R14.2 51.65,4.66 49.85,2.86 SV2.6
OUT14
  Bottom 0.254: R15.2 45.51,7.3 R16.2 45.51,4.66 47.31,2.86 SV2.7
OUT15
  Bottom 0.254: R18.2 45.51,16.61 43.81,14.92 43.81,10.79 | 43.81,10.79 43.81,4.76 44.77,3.81 SV2.8 | R17.2 43.92,10.9 43.81,10.79
OUT16
  Bottom 0.254: R28.2 41.49,16.61 43.18,14.92 43.18,10.79 | 43.18,10.79 43.18,4.76 42.23,3.81 SV2.9 | R27.2 43.08,10.9 43.18,10.79
OUT17
  Bottom 0.254: R29.2 41.49,7.3 R30.2 41.49,4.66 39.69,2.86 SV2.10
OUT22
  Bottom 0.254: R31.2 35.34,7.3 R32.2 35.34,4.66 37.15,2.86 SV2.11
OUT23
  Bottom 0.254: R34.2 35.34,16.61 33.66,14.92 33.66,10.79 | 33.66,10.79 33.66,4.76 34.61,3.81 SV2.12 | R33.2 33.76,10.9 33.66,10.79
OUT24
  Bottom 0.254: R20.2 31.33,16.61 33.02,14.92 33.02,10.79 | 33.02,10.79 33.02,4.76 32.07,3.81 SV2.13 | R19.2 32.92,10.9 33.02,10.79
OUT25
  Bottom 0.254: R21.2 31.33,7.3 R22.2 31.33,4.66 29.53,2.86 SV2.14
OUT30
  Bottom 0.254: R23.2 25.18,7.3 R24.2 25.18,4.66 26.99,2.86 SV2.15
OUT31
  Bottom 0.254: R26.2 25.18,16.61 23.5,14.92 23.5,10.79 | 23.5,10.79 23.5,4.76 24.45,3.81 SV2.16 | R25.2 23.6,10.9 23.5,10.79
V+
  Bottom 0.406: SV2.18 19.37,3.17 20.64,4.45 R2.2
V-
  Bottom 0.406: R1.2 20.64,6.99 16.83,3.17 SV2.19

### Text on the board
tNames: S & H caps - 10 nF